# Altium schematic sheet [7]-ADC CHIP.SchDoc
size A4; Organization: Altium Limited; Address1: L3, 12a Rodborough Rd; Address2: Frenchs Forest; Address3: NSW; Address4: Australia 2086
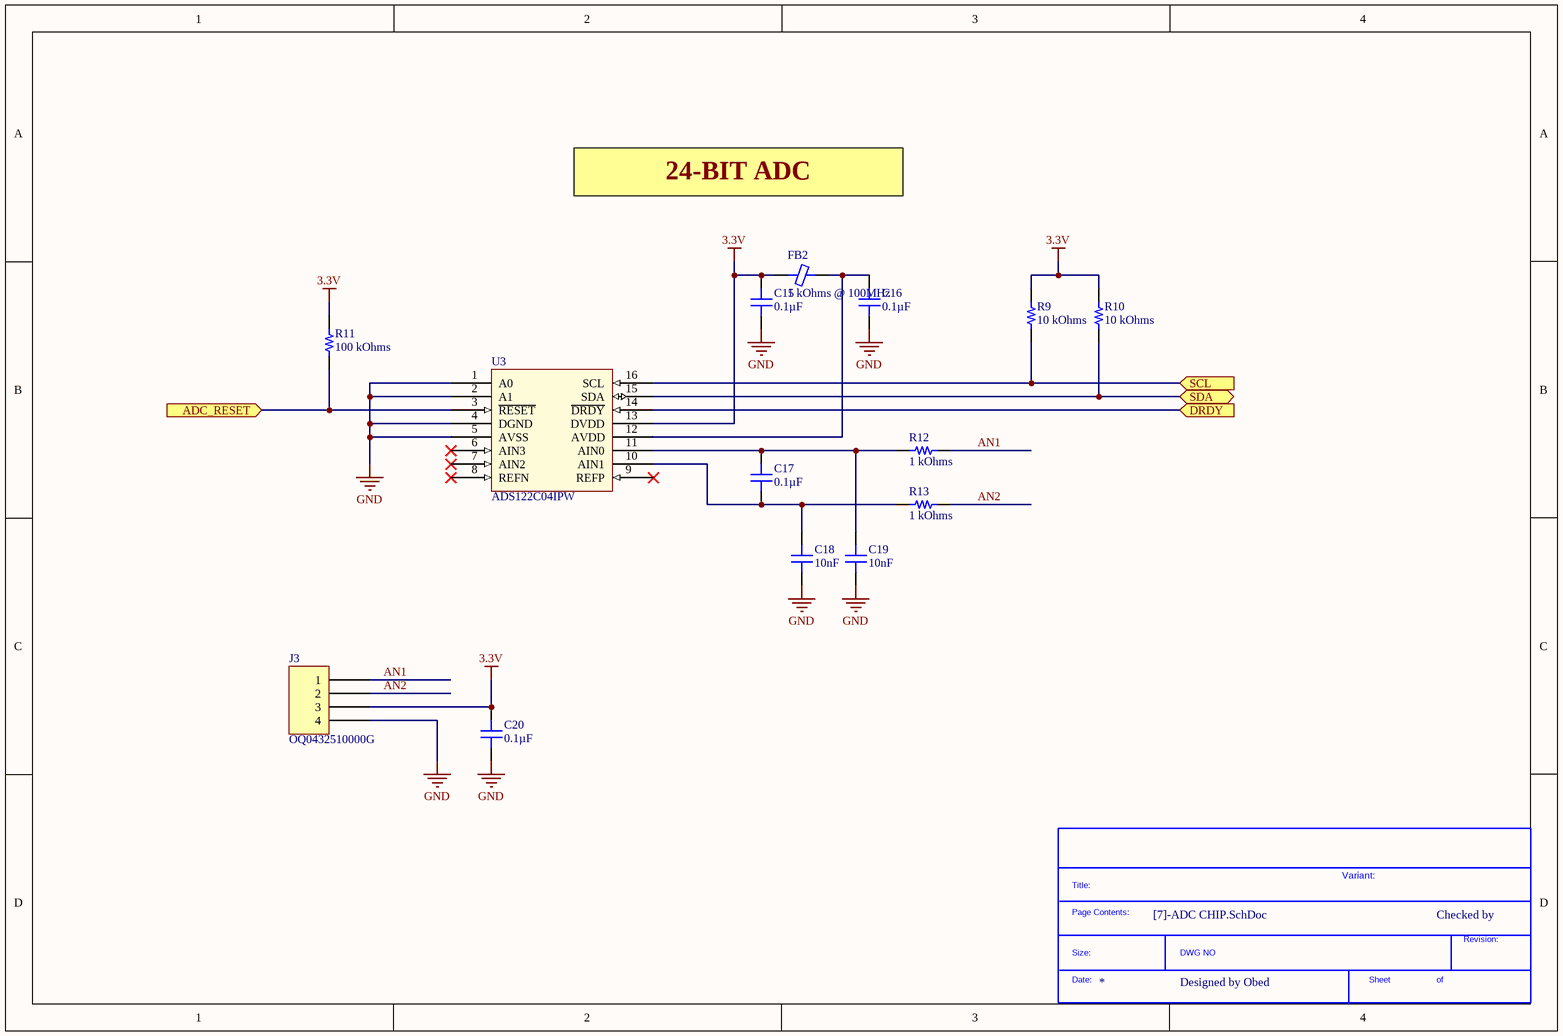
[diagram p0: [7]-ADC CHIP.SchDoc]

## Parts
*?  SDTitleBlock  (value not drawn)  (graphical)
C15  0.1µF  [CAP 0805_2012]
C16  0.1µF  [CAP 0805_2012]
C17  0.1µF  [CAP 0805_2012]
C18  10nF  [CAP 0805_2012]
C19  10nF  [CAP 0805_2012]
C20  0.1µF  [CAP 0805_2012]
FB2  1 kOhms @ 100MHz  [FER 1206_3216]
J3  OQ0432510000G  [FCI 06-381-4PIN]
R9  10 kOhms  [RES 0805_2012]
R10  10 kOhms  [RES 0805_2012]
R11  100 kOhms  [RES 0603_1608]
R12  1 kOhms  [RES 0603_1608]
R13  1 kOhms  [RES 0603_1608]
U3  ADS122C04IPW  [TSSOP16_25-59_294_54X14_SMT]

## Ports
ADC_RESET (in), DRDY (in), SCL (in), SDA (bidir)

## Nets
3.3V: C15.2 C20.2 FB2.1 J3.3 R9.2 R10.2 R11.2 U3.13(DVDD)
GND: C15.1 C16.1 C18.1 C19.1 C20.1 J3.4 U3.1(A0) U3.2(A1) U3.4(DGND) U3.5(AVSS)
ADC_RESET: R11.1 U3.3(~{RESET}) ; port ADC_RESET
AN1: J3.1 R12.2
AN2: J3.2 R13.2
DRDY: U3.14(~{DRDY}) ; port DRDY
SCL: R9.1 U3.16(SCL) ; port SCL
SDA: R10.1 U3.15(SDA) ; port SDA
NetC16_2: C16.2 FB2.2 U3.12(AVDD)
NetC17_1: C17.1 C18.2 R13.1 U3.10(AIN1)
NetC17_2: C17.2 C19.2 R12.1 U3.11(AIN0)

Not connected (* = marked no-connect by the designer): U3 6(AIN3)* 7(AIN2)* 8(REFN)* 9(REFP)*

## Notes on the sheet
- 24-BIT ADC
- Variant:
- Checked by
- Designed by Obed
- Title
- Size:
- Date:
- A4
- Number:
- Time:
- Revision:
- Sheet
- of
- File:
- (in symbol SDTitleBlock) Title:; Page Contents:; Revision:; Size:; DWG NO; Date:; Sheet; of

## Library data of the parts
C15-C17 C20 = 0805J0500104KXT: CAP CER 0.1UF 50V X7R 0805; Manufacturer: Knowles Syfer; Tolerance: ±10%; Part Number: 0805J0500104KXT; Applications: General Purpose; Capacitance: 0.1µF; ComponentLink1Description: Datasheet; ComponentLink1URL: https://www.knowlescapacitors.com/getattachment/2dbfc8bc-e2b3-4b4d-afb1-43b011b9ebe0/High-Std-Voltage.aspx; ComponentLink2Description: DigiKey Link; ComponentLink2URL: http://digikey.com/product-detail/en/knowles-syfer/0805J0500104KXT/1608-1000-1-ND/5730199; Device Package: 0805 (2012 Metric); LastUpdated: 02/09/2020 01:04:31; Lifecycle Status: Active; Minimum Order: 1; Mounting Type: Surface Mount, MLCC; Operating Temperature: -55°C ~ 125°C; Package / Case: 0805 (2012 Metric); Packaging: TapeAndReel; PartId: 8322; Part Status: Active; Price: 0.17; Series: -; Size / Dimension: 0.079" L x 0.049" W (2.00mm x 1.25mm); Supplier 1: DigiKey; Supplier Part Number 1: 1608-1000-1-ND; Temperature Coefficient: X7R; Thickness (Max): 0.051" (1.30mm); Voltage - Rated: 50V; Value: 0.1µF
C18 C19 = C0805C103K5GECAUTO: CAP CER 0805 10NF 50V C0G 10%; Manufacturer: KEMET; Capacitance: 10000pF; Temperature Coefficient: C0G, NP0; Part Number: C0805C103K5GECAUTO; Applications: Automotive, ESD Protection; ComponentLink1Description: Datasheet; ComponentLink1URL: https://api.kemet.com/component-edge/download/datasheet/C0805C103K5GECAUTO.pdf; ComponentLink2Description: DigiKey Link; ComponentLink2URL: http://digikey.com/product-detail/en/kemet/C0805C103K5GECAUTO/399-17903-1-ND/8640570; Device Package: 0805 (2012 Metric); Features: Low ESL; LastUpdated: 02/09/2020 01:04:06; Lifecycle Status: Active; Minimum Order: 1; Mounting Type: Surface Mount, MLCC; Operating Temperature: -55°C ~ 125°C; Package / Case: 0805 (2012 Metric); Packaging: TapeAndReel; PartId: 18336; Part Status: Active; Price: 0.06; Ratings: AEC-Q200; Series: ESD SMD Auto C0G; Size / Dimension: 0.079" L x 0.049" W (2.00mm x 1.25mm); Supplier 1: DigiKey; Supplier Part Number 1: 399-17903-1-ND; Thickness (Max): 0.039" (1.00mm); Tolerance: ±10%; Voltage - Rated: 50V; Value: 10nF
FB2 = BLM31KN102SZ1L: FERRITE BEAD 1 KOHM 1206 1LN; Manufacturer: Murata Electronics; Current Rating (Max): 2A; DC Resistance (DCR) (Max): 75mOhm; Filter Type: Power Line; Number of Lines: 1; Part Number: BLM31KN102SZ1L; ComponentLink1Description: Datasheet; ComponentLink1URL: https://www.murata.com/en-global/products/productdata/8796751200286/QNFA9115.pdf; ComponentLink2Description: DigiKey Link; ComponentLink2URL: http://digikey.com/product-detail/en/murata-electronics/BLM31KN102SZ1L/490-16522-1-ND/7564150; Device Package: 1206 (3216 Metric); Height (Max): 0.071" (1.80mm); Impedance @ Frequency: 1 kOhms @ 100MHz; LastUpdated: 02/09/2020 01:18:24; Lifecycle Status: Active; Minimum Order: 1; Mounting Type: Surface Mount; Operating Temperature: -55°C ~ 125°C; Package / Case: 1206 (3216 Metric); Packaging: TapeAndReel; PartId: 1565; Part Status: Active; Price: 0.10; Ratings: AEC-Q200; Series: BLM; Size / Dimension: 0.126" L x 0.063" W (3.20mm x 1.60mm); Supplier 1: DigiKey; Supplier Part Number 1: 490-16522-1-ND; Value: 1 kOhms @ 100MHz
J3 = OQ0432510000G: TERM BLOCK HDR 4POS 90DEG 3.81MM; Manufacturer: Amphenol Anytek; Current - UL: 10A; Header Orientation: 90°, Right Angle; Number of Levels: 1; Number of Positions: 4; Pitch: 0.150" (3.81mm); Voltage - UL: 300V; Part Number: OQ0432510000G; Color: Green; ComponentLink1Description: Datasheet; ComponentLink1URL: http://portal.fciconnect.com/Comergent//fci/drawing/oqxx32x100j0g.pdf; ComponentLink2Description: DigiKey Link; ComponentLink2URL: //digikey.com/product-detail/en/amphenol-anytek/OQ0432510000G/609-3821-ND/2261267; Contact Mating Finish: Tin; LastUpdated: 12/16/2019 19:15:03; Lifecycle Status: 0; Minimum Order: 1; Mounting Type: Through Hole; Operating Temperature: -40°C ~ 115°C; Packaging: Bulk; Part Status: Active; Positions Per Level: 4; Price: 0.71; Series: 06-381; Supplier 1: DigiKey; Supplier Part Number 1: 609-3821-ND; Termination Style: Solder; Type: Header, Male Pins, Shrouded (4 Side)
R9 R10 = CRCW080510K0FKEA: RES SMD 10K OHM 1% 1/8W 0805; Manufacturer: Vishay Dale; Power (Watts): 0.125W, 1/8W; Temperature Coefficient: ±100ppm/°C; Part Number: CRCW080510K0FKEA; ComponentLink1Description: Datasheet; ComponentLink1URL: http://www.vishay.com/docs/20035/dcrcwe3.pdf; ComponentLink2Description: DigiKey Link; ComponentLink2URL: http://digikey.com/product-detail/en/vishay-dale/CRCW080510K0FKEA/541-10.0KCCT-ND/1180897; Composition: Thick Film; Device Package: 0805 (2012 Metric); Features: Automotive AEC-Q200; Height - Seated (Max): 0.020" (0.50mm); LastUpdated: 02/09/2020 01:15:23; Lifecycle Status: Active; Minimum Order: 1; Number of Terminations: 2; Operating Temperature: -55°C ~ 155°C; Package / Case: 0805 (2012 Metric); Packaging: TapeAndReel; PartId: 28101; Part Status: Active; Price: 0.01; Ratings: AEC-Q200; Resistance: 10 kOhms; Series: CRCW; Size / Dimension: 0.079" L x 0.049" W (2.00mm x 1.25mm); Supplier 1: DigiKey; Supplier Part Number 1: 541-10.0KCCT-ND; Supplier Device Package: 0805; Tolerance: ±1%; Value: 10 kOhms
R11 = RT0603FRE07100KL: RES SMD 100K OHM 1% 1/10W 0603; Manufacturer: Yageo; Power (Watts): 0.1W, 1/10W; Temperature Coefficient: ±50ppm/°C; Part Number: RT0603FRE07100KL; ComponentLink1Description: Datasheet; ComponentLink1URL: https://www.yageo.com/upload/media/product/productsearch/datasheet/rchip/PYu-RT_1-to-0.01_RoHS_L_11.pdf; ComponentLink2Description: DigiKey Link; ComponentLink2URL: http://digikey.com/product-detail/en/yageo/RT0603FRE07100KL/YAG2319CT-ND/5252433; Composition: Thin Film; Device Package: 0603 (1608 Metric); Height - Seated (Max): 0.022" (0.55mm); LastUpdated: 9/2/2020 01:10:23; Lifecycle Status: Active; Minimum Order: 1; Number of Terminations: 2; Operating Temperature: -55°C ~ 155°C; Package / Case: 0603 (1608 Metric); Packaging: TapeAndReel; PartId: 5677; Part Status: Active; Price: 0.01; Resistance: 100 kOhms; Series: RT; Size / Dimension: 0.063" L x 0.031" W (1.60mm x 0.80mm); Supplier 1: DigiKey; Supplier Part Number 1: YAG2319CT-ND; Supplier Device Package: 0603; Tolerance: ±1%; Value: 100 kOhms
R12 R13 = CRCW06031K00FKEB: RES SMD 1K OHM 1% 1/10W 0603; Manufacturer: Vishay Dale; Power (Watts): 0.1W, 1/10W; Temperature Coefficient: ±100ppm/°C; Part Number: CRCW06031K00FKEB; ComponentLink1Description: Datasheet; ComponentLink1URL: http://www.vishay.com/docs/20035/dcrcwe3.pdf; ComponentLink2Description: DigiKey Link; ComponentLink2URL: http://digikey.com/product-detail/en/vishay-dale/CRCW06031K00FKEB/541-2985-1-ND/6073628; Composition: Thick Film; Device Package: 0603 (1608 Metric); Features: Automotive AEC-Q200; Height - Seated (Max): 0.020" (0.50mm); LastUpdated: 9/2/2020 01:10:24; Lifecycle Status: Active; Minimum Order: 1; Number of Terminations: 2; Operating Temperature: -55°C ~ 155°C; Package / Case: 0603 (1608 Metric); Packaging: CutTape; PartId: 5123; Part Status: Active; Price: 0.10; Ratings: AEC-Q200; Resistance: 1 kOhms; Series: CRCW; Size / Dimension: 0.063" L x 0.033" W (1.60mm x 0.85mm); Supplier 1: DigiKey; Supplier Part Number 1: 541-2985-1-ND; Supplier Device Package: 0603; Tolerance: ±1%; Value: 1 kOhms
U3 = IC_ADS122C04IPW: 24 Bit Analog to Digital Converter 4 Input 1 Sigma-Delta 16-TSSOP; Manufacturer: Texas Instruments; Alternate Part Number-1: NA; Manufacturer Part Number: ADS122C04IPW; Case/Package: TSSOP16; Supplier-1: MOUSER; Supplier Part Number-1: ADS122C04IPW